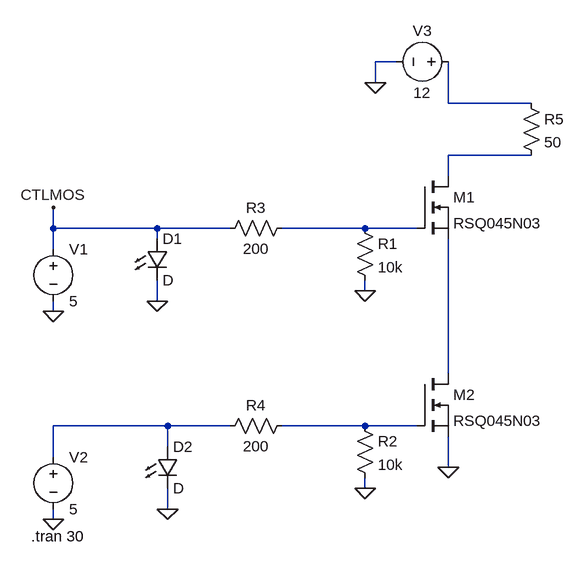
[diagram p0: schematic SafetyControlCircuit.asc]
SafetyControlCircuit.asc, the LTspice schematic file:
Version 4
SHEET 1 880 748
WIRE 144 0 112 0
WIRE 112 32 112 0
WIRE 224 64 224 0
WIRE 352 64 224 64
WIRE 352 144 224 144
WIRE 224 176 224 144
WIRE -384 256 -384 224
WIRE -224 256 -384 256
WIRE -112 256 -224 256
WIRE 96 256 -32 256
WIRE 176 256 96 256
WIRE -224 272 -224 256
WIRE -384 288 -384 256
WIRE 96 352 96 336
WIRE -224 368 -224 336
WIRE -384 384 -384 368
WIRE 224 480 224 272
WIRE -208 560 -384 560
WIRE -112 560 -208 560
WIRE 96 560 -32 560
WIRE 176 560 96 560
WIRE -208 592 -208 560
WIRE -384 608 -384 560
WIRE 224 624 224 576
WIRE 96 656 96 640
WIRE -208 688 -208 656
WIRE -384 704 -384 688
FLAG -208 688 0
FLAG -224 368 0
FLAG -384 224 CTLMOS
FLAG -384 384 0
FLAG -384 704 0
FLAG 96 352 0
FLAG 96 656 0
FLAG 224 624 0
FLAG 112 32 0
SYMBOL nmos 176 176 R0
SYMATTR InstName M1
SYMATTR Value RSQ045N03
SYMBOL nmos 176 480 R0
SYMATTR InstName M2
SYMATTR Value RSQ045N03
SYMBOL res 80 240 R0
SYMATTR InstName R1
SYMATTR Value 10k
SYMBOL res 80 544 R0
SYMATTR InstName R2
SYMATTR Value 10k
SYMBOL res -128 272 R270
WINDOW 0 32 56 VTop 2
WINDOW 3 0 56 VBottom 2
SYMATTR InstName R3
SYMATTR Value 200
SYMBOL res -128 576 R270
WINDOW 0 32 56 VTop 2
WINDOW 3 0 56 VBottom 2
SYMATTR InstName R4
SYMATTR Value 200
SYMBOL LED -240 272 R0
SYMATTR InstName D1
SYMBOL LED -224 592 R0
SYMATTR InstName D2
SYMBOL voltage -384 272 R0
WINDOW 123 0 0 Left 0
WINDOW 39 0 0 Left 0
SYMATTR InstName V1
SYMATTR Value 5
SYMBOL voltage -384 592 R0
WINDOW 123 0 0 Left 0
WINDOW 39 0 0 Left 0
SYMATTR InstName V2
SYMATTR Value 5
SYMBOL res 336 48 R0
SYMATTR InstName R5
SYMATTR Value 50
SYMBOL voltage 240 0 R90
WINDOW 0 -32 56 VBottom 2
WINDOW 3 32 56 VTop 2
WINDOW 123 0 0 Left 0
WINDOW 39 0 0 Left 0
SYMATTR InstName V3
SYMATTR Value 12
TEXT -418 730 Left 2 !.tran 30

The netlist it stands for:
* SafetyControlCircuit.asc
M1 N002 N003 N004 N004 RSQ045N03
M2 N004 N006 0 0 RSQ045N03
R1 N003 0 10k
R2 N006 0 10k
R3 CTLMOS N003 200
R4 N005 N006 200
D1 CTLMOS 0 D
D2 N005 0 D
V1 CTLMOS 0 5
V2 N005 0 5
R5 N001 N002 50
V3 N001 0 12
.model D D
.lib standard.dio
.model NMOS NMOS
.model PMOS PMOS
.lib standard.mos
.tran 30
.backanno
.end